# EAGLE schematic bk-circ3-S (EAGLE 9.1.0)
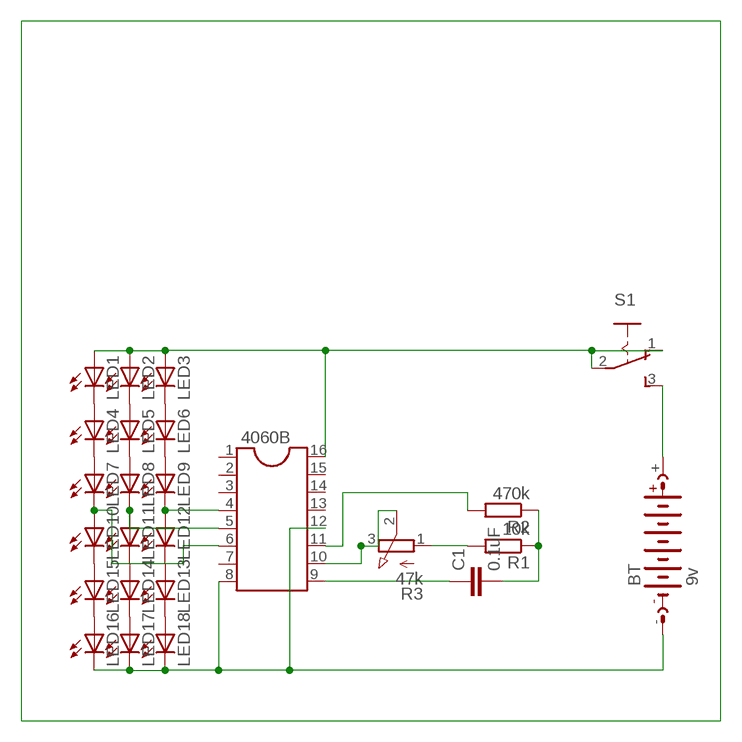
[diagram p0: schematic, sheet 1]

## Parts
4060B  DIL16  [DIL16]
BT  9v  AB9V  [AB9V]
C1  0.1uF  C-EU050-030X075  [C050-030X075]
LED1  LED3MM  [LED3MM]
LED2  LED3MM  [LED3MM]
LED3  LED3MM  [LED3MM]
LED4  LED3MM  [LED3MM]
LED5  LED3MM  [LED3MM]
LED6  LED3MM  [LED3MM]
LED7  LED3MM  [LED3MM]
LED8  LED3MM  [LED3MM]
LED9  LED3MM  [LED3MM]
LED10  LED3MM  [LED3MM]
LED11  LED3MM  [LED3MM]
LED12  LED3MM  [LED3MM]
LED13  LED3MM  [LED3MM]
LED14  LED3MM  [LED3MM]
LED15  LED3MM  [LED3MM]
LED16  LED3MM  [LED3MM]
LED17  LED3MM  [LED3MM]
LED18  LED3MM  [LED3MM]
R1  10k  R-EU_0207/7  [0207/7]
R2  470k  R-EU_0207/7  [0207/7]
R3  47k  3RP/1610N  [3RP/1610N]
S1  255SB  [255SB]

## Nets
N$1: LED1.K(C) LED4.A
N$2: LED2.K(C) LED5.A
N$3: LED3.K(C) LED6.A
N$4: LED4.K(C) LED7.A
N$5: LED5.K(C) LED8.A
N$6: LED6.K(C) LED9.A
N$8: 4060B.5 LED8.K(C) LED11.A
N$9: C1.2 R1.1 R2.1
N$10: LED11.K(C) LED14.A
N$11: LED10.K(C) LED15.A
N$12: LED12.K(C) LED13.A
N$13: LED15.K(C) LED16.A
N$14: LED14.K(C) LED17.A
N$15: LED13.K(C) LED18.A
N$16: 4060B.9 C1.1
N$17: 4060B.10 R3.2(S) R3.3(E)
N$18: 4060B.8 4060B.12 BT.- LED16.K(C) LED17.K(C) LED18.K(C)
N$19: R1.2 R3.1(A)
N$20: 4060B.4 LED9.K(C) LED12.A
N$21: 4060B.6 LED7.K(C) LED10.A
N$22: 4060B.11 R2.2
N$23: BT.+ S1.3(S)
N$24: 4060B.16 LED1.A LED2.A LED3.A S1.1(O) S1.2(P)
Unconnected: 4060B.1 4060B.2 4060B.3 4060B.7 4060B.13 4060B.14 4060B.15

## Library data of the parts
4060B = ic-package:DIL16: Dual In Line / Socket
BT = battery:AB9V: 9-V BATTERY CLIP
C1 = resistor:C-EU: CAPACITOR, European symbol
LED1-LED18 = led:LED: LED OSRAM: - CHIPLED LG R971, LG N971, LY N971, LG Q971, LY Q971, LO R971, LY R971 LH N974, LH R974 LS Q976, LO Q976, LY Q976 LO Q996 - Hyper CHIPLED LW Q18S LB Q993, LB Q99A, LB R99A - SideLED LS A670, LO A670, LY A670, LG A670, LP A670 LB A673, LV A673, LT A673, LW A673 LH A674 LY A675 LS A676, LA A676, LO A676, LY A676, LW A676 LS A679, LY A679, LG A679 - Hyper Micro SIDELED® LS Y876, LA Y876, LO Y876, LY Y876 LT Y87S - SmartLED LW L88C, LW L88S LB L89C, LB L89S, LG L890 LS L89K, LO L89K, LY L89K LS L896, LA L896, LO L896, LY L896 - TOPLED LS T670, LO T670, LY T670, LG T670, LP T670 LSG T670, LSP T670, LSY T670, LOP T670, LYG T670 LG T671, LOG T671, LSG T671 LB T673, LV T673, LT T673, LW T673 LH T674 LS T676, LA T676, LO T676, LY T676, LB T676, LH T676, LSB T676, LW T676 LB T67C, LV T67C, LT T67C, LS T67K, LO T67K, LY T67K, LW E67C LS E67B, LA E67B, LO E67B, LY E67B, LB E67C, LV E67C, LT E67C LW T67C LS T679, LY T679, LG T679 LS T770, LO T770, LY T770, LG T770, LP T770 LB T773, LV T773, LT T773, LW T773 LH T774 LS E675, LA E675, LY E675, LS T675 LS T776, LA T776, LO T776, LY T776, LB T776 LHGB T686 LT T68C, LB T68C - Hyper Mini TOPLED® LB M676 - Mini TOPLED Santana® LG M470 LS M47K, LO M47K, LY M47K Source: http://www.osram.convergy.de LUXEON: - LUMILED® LXK2-PW12-R00, LXK2-PW12-S00, LXK2-PW14-U00, LXK2-PW14-V00 LXK2-PM12-R00, LXK2-PM12-S00, LXK2-PM14-U00 LXK2-PE12-Q00, LXK2-PE12-R00, LXK2-PE12-S00, LXK2-PE14-T00, LXK2-PE14-U00 LXK2-PB12-K00, LXK2-PB12-L00, LXK2-PB12-M00, LXK2-PB14-N00, LXK2-PB14-P00, LXK2-PB14-Q00 LXK2-PR12-L00, LXK2-PR12-M00, LXK2-PR14-Q00, LXK2-PR14-R00 LXK2-PD12-Q00, LXK2-PD12-R00, LXK2-PD12-S00 LXK2-PH12-R00, LXK2-PH12-S00 LXK2-PL12-P00, LXK2-PL12-Q00, LXK2-PL12-R00 Source: www.luxeon.com KINGBRIGHT: KA-3528ASYC Source: www.kingbright.com
R1 R2 = resistor:R-EU_: RESISTOR, European symbol
R3 = pot:3RP/1610N: 16mm Potentiometer one level Source: http://www.alphapotentiometers.net/html/16mm_pot_2.html
S1 = switch:255SB: SLIDING SWITCH Distributor Buerklin, 11G810